# Altium schematic sheet System Control - Bank3.SchDoc
size C
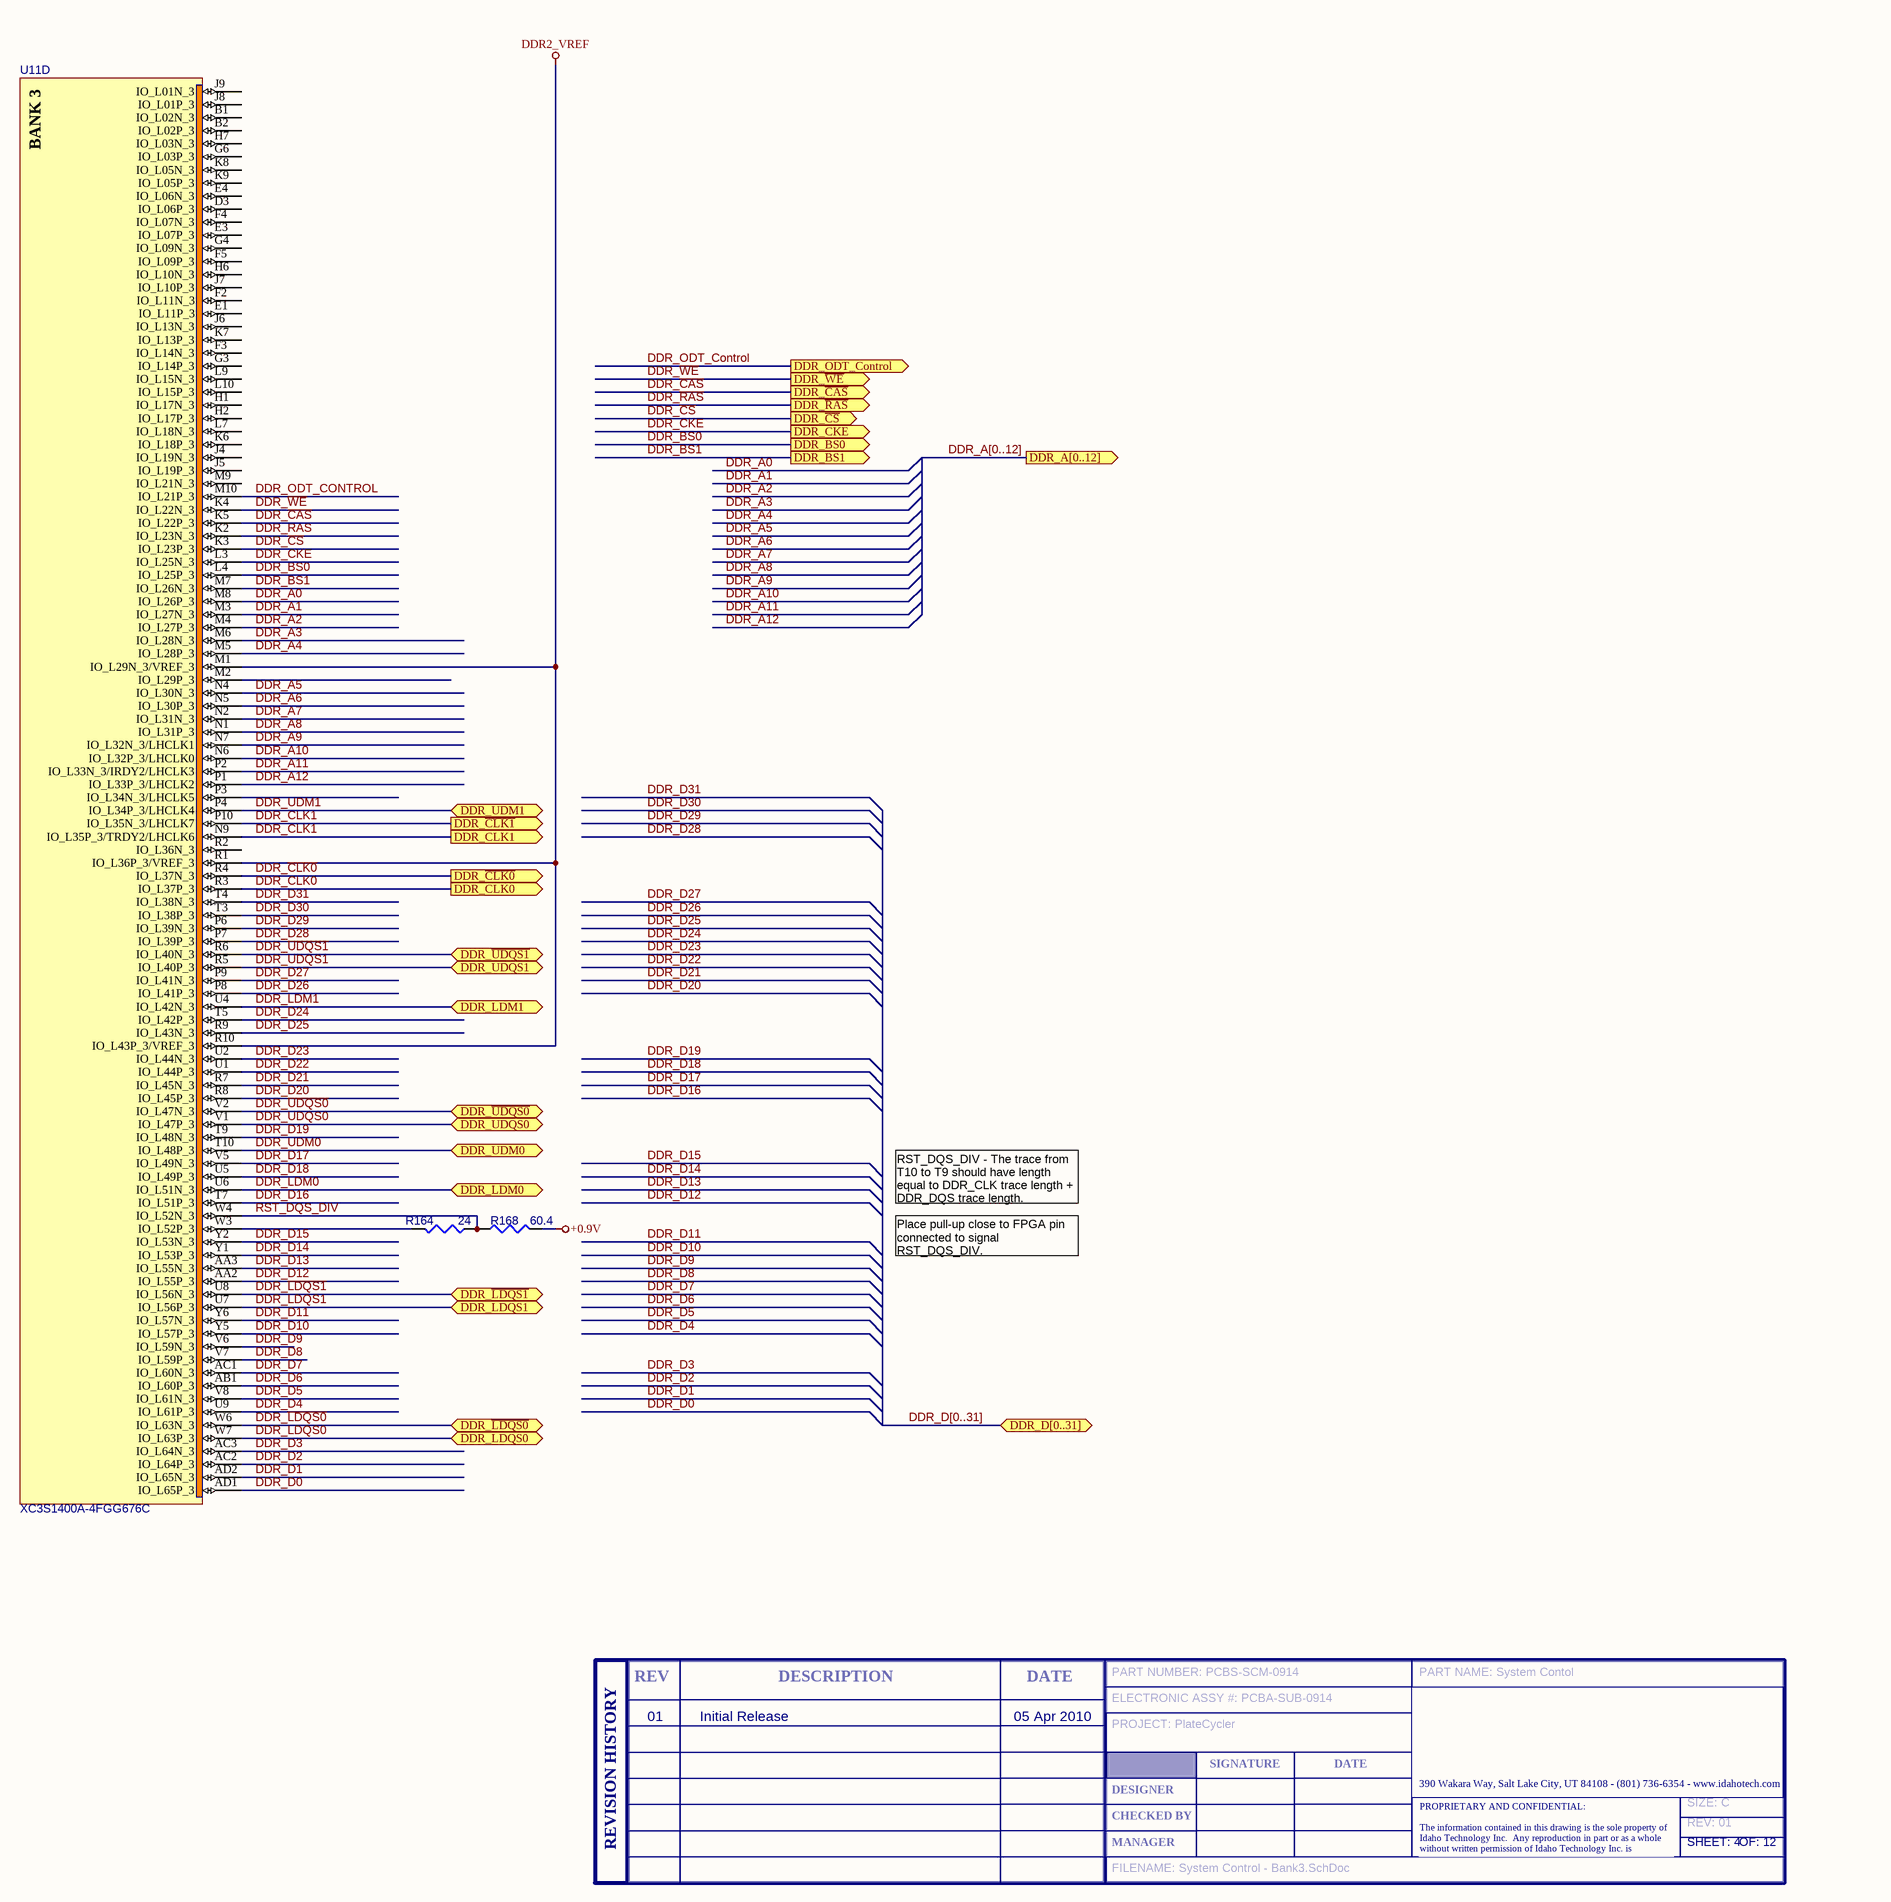
[diagram p0: System Control - Bank3.SchDoc]

## Parts
R164  24  [SM/R_0402]
R168  60.4  [SM/R_0402]
T?  SIZE: C  REV: 01  FILENAME: System Control - Bank3.SchDoc  PART NUMBER: PCBS-SCM-0914  PART NAME: System Contol  ELECTRONIC ASSY #: PCBA-SUB-0914  PROJECT: PlateCycler  SHEET: 4  OF: 12  (hidden comment: ITI Title Block, A Size)  (graphical)
U11  XC3S1400A-4FGG676C  [FGG676]  (part D of 9)

## Ports
DDR_A[0..12] (out), DDR_BS0 (out), DDR_BS1 (out), DDR_CKE (out), DDR_CLK0 (out), DDR_CLK1 (out), DDR_D[0..31] (bidir), DDR_LDM0 (bidir), DDR_LDM1 (bidir), DDR_LDQS0 (bidir), DDR_LDQS1 (bidir), DDR_ODT_Control (out), DDR_UDM0 (bidir), DDR_UDM1 (bidir), DDR_UDQS0 (bidir), DDR_UDQS1 (bidir), DDR_~{CAS} (out), DDR_~{CLK0} (out), DDR_~{CLK1} (out), DDR_~{CS} (out), DDR_~{LDQS0} (bidir), DDR_~{LDQS1} (bidir), DDR_~{RAS} (out), DDR_~{UDQS0} (bidir), DDR_~{UDQS1} (bidir), DDR_~{WE} (out)

## Nets
+0.9V: R168.2
DDR2_VREF: U11.M1(IO_L29N_3/VREF_3) U11.R1(IO_L36P_3/VREF_3) U11.R10(IO_L43P_3/VREF_3)
DDR_A0: U11.M8(IO_L26P_3)
DDR_A1: U11.M3(IO_L27N_3)
DDR_A2: U11.M4(IO_L27P_3)
DDR_A3: U11.M6(IO_L28N_3)
DDR_A4: U11.M5(IO_L28P_3)
DDR_A5: U11.N4(IO_L30N_3)
DDR_A6: U11.N5(IO_L30P_3)
DDR_A7: U11.N2(IO_L31N_3)
DDR_A8: U11.N1(IO_L31P_3)
DDR_A9: U11.N7(IO_L32N_3/LHCLK1)
DDR_A10: U11.N6(IO_L32P_3/LHCLK0)
DDR_A11: U11.P2(IO_L33N_3/IRDY2/LHCLK3)
DDR_A12: U11.P1(IO_L33P_3/LHCLK2)
DDR_BS0: U11.L4(IO_L25P_3) ; port DDR_BS0
DDR_BS1: U11.M7(IO_L26N_3) ; port DDR_BS1
DDR_~{CAS}: U11.K5(IO_L22P_3) ; port DDR_~{CAS}
DDR_~{CLK0}: U11.R4(IO_L37N_3) ; port DDR_~{CLK0}
DDR_~{CLK1}: U11.P10(IO_L35N_3/LHCLK7) ; port DDR_~{CLK1}
DDR_~{CS}: U11.K3(IO_L23P_3) ; port DDR_~{CS}
DDR_CKE: U11.L3(IO_L25N_3) ; port DDR_CKE
DDR_CLK0: U11.R3(IO_L37P_3) ; port DDR_CLK0
DDR_CLK1: U11.N9(IO_L35P_3/TRDY2/LHCLK6) ; port DDR_CLK1
DDR_D0: U11.AD1(IO_L65P_3)
DDR_D1: U11.AD2(IO_L65N_3)
DDR_D2: U11.AC2(IO_L64P_3)
DDR_D3: U11.AC3(IO_L64N_3)
DDR_D4: U11.U9(IO_L61P_3)
DDR_D5: U11.V8(IO_L61N_3)
DDR_D6: U11.AB1(IO_L60P_3)
DDR_D7: U11.AC1(IO_L60N_3)
DDR_D8: U11.V7(IO_L59P_3)
DDR_D9: U11.V6(IO_L59N_3)
DDR_D10: U11.Y5(IO_L57P_3)
DDR_D11: U11.Y6(IO_L57N_3)
DDR_D12: U11.AA2(IO_L55P_3)
DDR_D13: U11.AA3(IO_L55N_3)
DDR_D14: U11.Y1(IO_L53P_3)
DDR_D15: U11.Y2(IO_L53N_3)
DDR_D16: U11.T7(IO_L51P_3)
DDR_D17: U11.V5(IO_L49N_3)
DDR_D18: U11.U5(IO_L49P_3)
DDR_D19: U11.T9(IO_L48N_3)
DDR_D20: U11.R8(IO_L45P_3)
DDR_D21: U11.R7(IO_L45N_3)
DDR_D22: U11.U1(IO_L44P_3)
DDR_D23: U11.U2(IO_L44N_3)
DDR_D24: U11.T5(IO_L42P_3)
DDR_D25: U11.R9(IO_L43N_3)
DDR_D26: U11.P8(IO_L41P_3)
DDR_D27: U11.P9(IO_L41N_3)
DDR_D28: U11.P7(IO_L39P_3)
DDR_D29: U11.P6(IO_L39N_3)
DDR_D30: U11.T3(IO_L38P_3)
DDR_D31: U11.T4(IO_L38N_3)
DDR_~{LDQS0}: U11.W6(IO_L63N_3) ; port DDR_~{LDQS0}
DDR_~{LDQS1}: U11.U8(IO_L56N_3) ; port DDR_~{LDQS1}
DDR_LDM0: U11.U6(IO_L51N_3) ; port DDR_LDM0
DDR_LDM1: U11.U4(IO_L42N_3) ; port DDR_LDM1
DDR_LDQS0: U11.W7(IO_L63P_3) ; port DDR_LDQS0
DDR_LDQS1: U11.U7(IO_L56P_3) ; port DDR_LDQS1
DDR_ODT_Control: U11.M10(IO_L21P_3) ; port DDR_ODT_Control
DDR_~{RAS}: U11.K2(IO_L23N_3) ; port DDR_~{RAS}
DDR_~{UDQS0}: U11.V2(IO_L47N_3) ; port DDR_~{UDQS0}
DDR_~{UDQS1}: U11.R6(IO_L40N_3) ; port DDR_~{UDQS1}
DDR_UDM0: U11.T10(IO_L48P_3) ; port DDR_UDM0
DDR_UDM1: U11.P4(IO_L34P_3/LHCLK4) ; port DDR_UDM1
DDR_UDQS0: U11.V1(IO_L47P_3) ; port DDR_UDQS0
DDR_UDQS1: U11.R5(IO_L40P_3) ; port DDR_UDQS1
DDR_~{WE}: U11.K4(IO_L22N_3) ; port DDR_~{WE}
RST_DQS_DIV: R164.1 R168.1 U11.W4(IO_L52N_3)
NetR164_2: R164.2 U11.W3(IO_L52P_3)

Not connected (* = marked no-connect by the designer): U11 B1(IO_L02N_3) B2(IO_L02P_3) D3(IO_L06P_3) E1(IO_L11P_3) E3(IO_L07P_3) E4(IO_L06N_3) F2(IO_L11N_3) F3(IO_L14N_3) F4(IO_L07N_3) F5(IO_L09P_3) G3(IO_L14P_3) G4(IO_L09N_3) G6(IO_L03P_3) H1(IO_L17N_3) H2(IO_L17P_3) H6(IO_L10N_3) H7(IO_L03N_3) J4(IO_L19N_3) J5(IO_L19P_3) J6(IO_L13N_3) J7(IO_L10P_3) J8(IO_L01P_3) J9(IO_L01N_3) K6(IO_L18P_3) K7(IO_L13P_3) K8(IO_L05N_3) K9(IO_L05P_3) L7(IO_L18N_3) L9(IO_L15N_3) L10(IO_L15P_3) M2(IO_L29P_3) M9(IO_L21N_3) P3(IO_L34N_3/LHCLK5) R2(IO_L36N_3)

## Buses and harness runs
bus DDR_A[0..12] = port DDR_A[0..12]
bus DDR_D[0..31] = port DDR_D[0..31]

## Notes on the sheet
- RST_DQS_DIV - The trace from T10 to T9 should have length equal to DDR_CLK trace length + DDR_DQS trace length.
- Place pull-up close to FPGA pin connected to signal RST_DQS_DIV.
- 01
- Initial Release
- 05 Apr 2010
- (in symbol ITI A-size Title Block and Rev Table) REV; DESCRIPTION; DATE; SIGNATURE; 390 Wakara Way, Salt Lake City, UT 84108 - (801) 736-6354 - www.idahotech.com; DESIGNER; CHECKED BY; REVISION HISTORY; MANAGER; PROPRIETARY AND CONFIDENTIAL: / The information contained in this drawing is the sole property of / Idaho Technology Inc.  Any reproduction in part or as a whole / without written permission of Idaho Technology Inc. is prohibited.
- (in symbol XC3S1400A-4FGG676C, part D) BANK 3

## Library data of the parts
R164 = R1K 5% 0603: RES 24.0 OHM 1/16W 1% 0402 SMD; Manufacturer: Panasonic; Manufacturer P/N: ERJ-2RKF24R0X; Vendor: Digikey; Vendor P/N: P24.0LCT-ND
R168 = R1K 5% 0603: RES 60.4 OHM 1/16W 1% 0402 SMD; Manufacturer: Panasonic; Manufacturer P/N: ERJ-2RKF60R4X; Vendor: Digikey; Vendor P/N: P60.4LCT-ND
T? = ITI A-size Title Block and Rev Table: ITI Title Block and Rev Table, A Size
U11 = XC3S1400A-4FGG676C: Spartan-3A  I/O Optimized FPGA, 502 User I/Os, 676-Pin Pb-Free FBGA, Standard Performance, Commercial Grade; Published: 12-Dec-2006; DatasheetVersion: 08-May-2007; PackageVersion: ver1.2.1, Apr-2005; PackageReference: FGG676; Publisher: Altium Limited; PackageDescription: 676-Ball Fine Pitch Ball Grid Array (FGG676) - Pb-Free; Code_JEDEC: MS-034-AAL-1; Code_IPC: BGA100P26X26-676; ComponentLink1Description: Manufacturer Link; ComponentLink1URL: http://www.xilinx.com/products/silicon_solutions/fpgas/spartan_series/spartan3a_fpgas/index.htm; ComponentLink2Description: Datasheet; ComponentLink2URL: http://direct.xilinx.com/bvdocs/publications/ds529.pdf